# Altium schematic sheet 795498646NUCLEO-DG_V3_ST_LINK_V2-1.SCHDOC: STLINK/V2-1
size A4; DocumentNumber: MB1136; Revision: C.3; SheetNumber: 3; SheetTotal: 4; Project: NUCLEO-XXXXRX
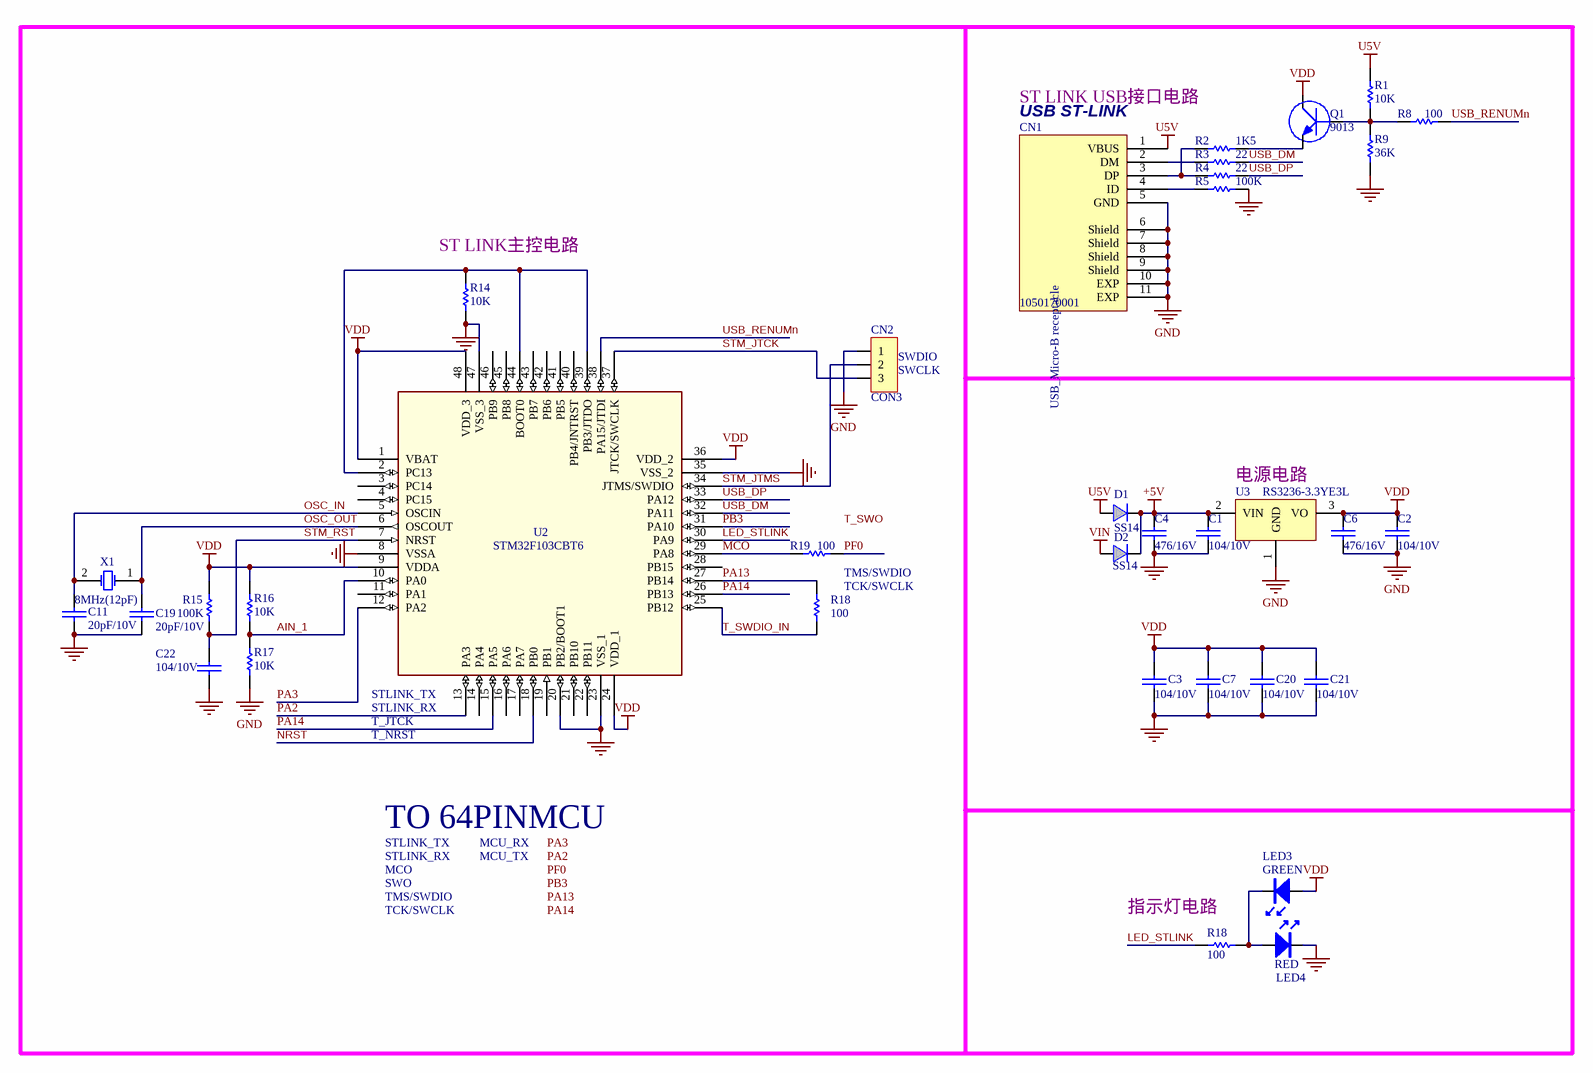
[diagram p0: 795498646NUCLEO-DG_V3_ST_LINK_V2-1.SCHDOC]

## Parts
(Parts that share a designator on the sheet are numbered #1, #2 ... from top to bottom, then left to right.)
C1  104/10V  [0603C]
C2  104/10V  [0603C]
C3  104/10V  [0603C]
C4  476/16V  [0805C]
C6  476/16V  [0805C]
C7  104/10V  [0603C]
C11  20pF/10V  [0603C]
C19  20pF/10V  [0603C]
C20  104/10V  [0603C]
C21  104/10V  [0603C]
C22  104/10V  [0603C]
CN1  1050170001  [Molex_1050170001]
CN2  CON3  [SIP3]
D1  SS14  [TP4007]
D2  SS14  [TP4007]
LED3  GREEN  [0603D]
LED4  RED  [0603D]
Q1  9013  [SOT23-NPN]
R1  10K  [0603]
R2  1K5  [0603]
R3  22  [0603]
R4  22  [0603]
R5  100K  [0603]
R8  100  [0603]
R9  36K  [0603]
R14  10K  [0603]
R15  100K  [0603]
R16  10K  [0603]
R17  10K  [0603]
R18#1  100  [0603]
R18#2  100  [0603]
R19  100  [0603]
U2  STM32F103CBT6  [QFP48 7X7]
U3  RS3236-3.3YE3L  [SOT-89]
X1  8MHz(12pF)  [XTAL-5032]

## Nets
+5V: C1.1 C4.1 D1.K D2.K U3.2(VIN)
GND: C1.2 C2.2 C3.2 C4.2 C6.2 C7.2 C11.2 C19.2 C20.2 C21.2 C22.2 CN1.5(GND) CN1.6(Shield) CN1.7(Shield) CN1.8(Shield) CN1.9(Shield) CN1.10(EXP) CN1.11(EXP) CN2.1 LED4.K R5.2 R9.1 R14.1 R17.2 U2.8(VSSA) U2.20(PB2/BOOT1) U2.23(VSS_1) U2.35(VSS_2) U2.47(VSS_3) U3.1(GND)
U5V: CN1.1(VBUS) D1.A R1.2
VDD: C2.1 C3.1 C6.1 C7.1 C20.1 C21.1 LED3.A Q1.C R15.2 R16.1 U2.1(VBAT) U2.9(VDDA) U2.24(VDD_1) U2.36(VDD_2) U2.48(VDD_3) U3.3(VO)
VIN: D2.A
AIN_1: R16.2 R17.1 U2.10(PA0)
LED_STLINK: R18#2.1 U2.30(PA9)
MCO: R19.1 U2.29(PA8)
NRST: U2.18(PB0)
OSC_IN: C11.1 U2.5(OSCIN) X1.2(OSC2)
OSC_OUT: C19.1 U2.6(OSCOUT) X1.1(OSC1)
PA2: U2.13(PA3)
PA3: U2.12(PA2)
PA13: R18#1.2 U2.27(PB14)
PA14: U2.15(PA5) U2.26(PB13)
PB3: U2.31(PA10)
PF0: R19.2
STM_JTCK: CN2.3 U2.37(JTCK/SWCLK)
STM_JTMS: CN2.2 U2.34(JTMS/SWDIO)
STM_RST: C22.1 R15.1 U2.7(NRST)
T_SWDIO_IN: R18#1.1 U2.25(PB12)
USB_DM: R3.2 U2.32(PA11)
USB_DP: R4.2 U2.33(PA12)
USB_RENUMn: R8.2 U2.38(PA15/JTDI)
NetCN1_2: CN1.2(DM) R3.1
NetCN1_3: CN1.3(DP) R2.1 R4.1
NetCN1_4: CN1.4(ID) R5.1
NetLED3_K: LED3.K LED4.A R18#2.2
NetQ1_B: Q1.B R1.1 R8.1 R9.2
NetQ1_E: Q1.E R2.2
NetR14_2: R14.2 U2.2(PC13) U2.39(PB3/JTDO) U2.44(BOOT0)

Not connected (* = marked no-connect by the designer): U2 3(PC14) 4(PC15) 11(PA1) 14(PA4) 16(PA6) 17(PA7) 19(PB1) 21(PB10) 22(PB11) 28(PB15) 40(PB4/JNTRST) 41(PB5) 42(PB6) 43(PB7) 45(PB8) 46(PB9)

## Notes on the sheet
- (near CN1) USB ST-LINK
- (near CN1) ST LINK USB接口电路
- (near R14) ST LINK主控电路
- (near CN2) SWCLK
- (near CN2) SWDIO
- (near U3) 电源电路
- TCK/SWCLK
- TMS/SWDIO
- (near U2) STLINK_RX
- (near U2) STLINK_TX
- T_NRST
- (near U2) T_JTCK
- TO 64PINMCU
- STLINK_RX
- STLINK_TX
- MCO
- MCU_RX
- MCU_TX
- SWO
- (near R18#2) 指示灯电路
- Labels drawn without touching a wire or pin: PA2, PA3, PA13, PA14, PB3, PF0, T_SWO
- Title:
- Project:
- Size:
- Date:
- A4
- Reference:
- Sheet:
- Revision:
- of
- (in symbol 1050170001) USB_Micro-B receptacle

## Library data of the parts
C1-C4 C6 C7 C19-C22 = C
C11 = CAP: Capacitor
CN1 = 1050170001: Silkscreen: USB
CN2 = CON3: CN
D1 D2 = D
LED3 LED4 = LED
Q1 = NPN: Q
R1 R9 = Res1: Resistor; Value: 1K; Published: 8-Jun-2000; Revision: July-2002: Re-released for DXP Platform.; Publisher: Altium Limited
R2-R5 R8 R15 R18#1 R18#2 R19 = Resistor_ST: Resistor 0402 / 0603 / 0805; Value: 10K
R14 = Resistor_ST: Resistor 0402 / 0603 / 0805; Value: 10K
R16 R17 = Resistor_ST: Resistor 0402 / 0603 / 0805; Fitted: NO; Value: 10K
U2 = STM32F103CBT6: Medium-density performance line ARM-based 32-bit MCU with 64KB Flash; Manuf_Part_1: STM32F103C8T6; Manuf_1: STM; Ref St: 9175981; Provided: ST; ECCN_US/EU: 3A991A2/NEC; Distrib: ST; Order: STM32F103C8T6
U3 = HT7130: IC
X1 = XTAL: Crystal Oscillator; Published: 8-Jun-2000; LatestRevisionDate: 17-Jul-2002; LatestRevisionNote: Re-released for DXP Platform.; PackageReference: R38; Publisher: Altium Limited